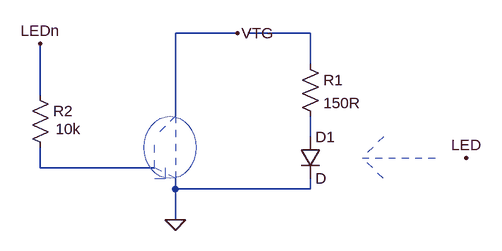
[diagram p0: schematic Question_8.asc]
Question_8.asc, the LTspice schematic file:
Version 4
SHEET 1 1080 716
WIRE 480 256 384 256
WIRE 592 256 496 256
WIRE 592 304 592 256
WIRE 176 352 176 272
WIRE 384 384 384 256
WIRE 592 416 592 384
WIRE 176 464 176 432
WIRE 352 464 176 464
WIRE 384 496 384 480
WIRE 592 496 592 480
WIRE 592 496 384 496
WIRE 384 544 384 496
FLAG 480 256 VTG
FLAG 176 272 LEDn
FLAG 384 544 0
FLAG 832 448 LED
SYMBOL res 576 288 R0
SYMATTR InstName R1
SYMATTR Value 150R
SYMBOL res 160 336 R0
WINDOW 3 40 68 Left 2
SYMATTR InstName R2
SYMATTR Value 10k
SYMBOL diode 576 416 R0
SYMATTR InstName D1
LINE Normal 352 464 352 416 2
LINE Normal 384 480 352 464 2
LINE Normal 384 384 384 480 2
LINE Normal 384 384 352 416 2
LINE Normal 672 448 784 448 2
LINE Normal 704 416 672 448 2
LINE Normal 704 480 672 448 2
LINE Normal 368 464 368 480 2
LINE Normal 352 480 368 480 2
CIRCLE Normal 416 384 336 480 2

The netlist it stands for:
* Question_8.asc
R1 N001 N002 150R
R2 LEDn N003 10k
D1 N002 0 D
.model D D
.lib standard.dio
.backanno
.end